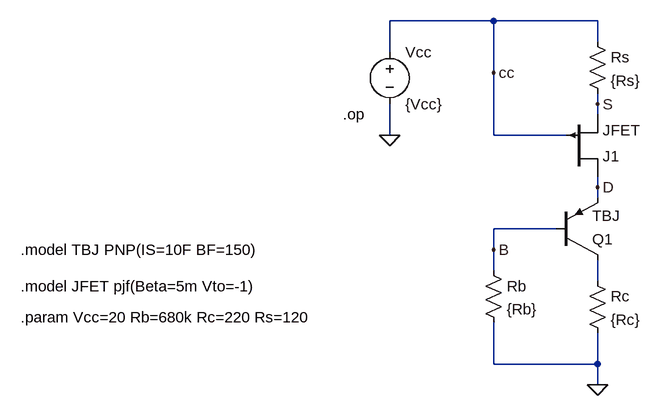
[diagram p0: schematic COMB00bop.asc]
COMB00bop.asc, the LTspice schematic file:
Version 4
SHEET 1 1608 1076
WIRE 1024 -224 864 -224
WIRE 1184 -224 1024 -224
WIRE 1184 -192 1184 -224
WIRE 864 -176 864 -224
WIRE 1024 -144 1024 -224
WIRE 1184 -96 1184 -112
WIRE 1184 -80 1184 -96
WIRE 864 -48 864 -96
WIRE 1024 -48 1024 -144
WIRE 1136 -48 1024 -48
WIRE 1184 32 1184 16
WIRE 1184 48 1184 32
WIRE 1120 96 1024 96
WIRE 1024 128 1024 96
WIRE 1024 160 1024 128
WIRE 1184 176 1184 144
WIRE 1024 304 1024 240
WIRE 1184 304 1184 256
WIRE 1184 304 1024 304
WIRE 1184 336 1184 304
FLAG 1184 336 0
FLAG 864 -48 0
FLAG 1024 -144 cc
FLAG 1024 128 B
FLAG 1184 -96 S
FLAG 1184 32 D
SYMBOL res 1008 144 R0
SYMATTR InstName Rb
SYMATTR Value {Rb}
SYMBOL res 1168 160 R0
SYMATTR InstName Rc
SYMATTR Value {Rc}
SYMBOL voltage 864 -192 R0
WINDOW 123 0 0 Left 0
WINDOW 39 0 0 Left 0
SYMATTR InstName Vcc
SYMATTR Value {Vcc}
SYMBOL res 1168 -208 R0
SYMATTR InstName Rs
SYMATTR Value {Rs}
SYMBOL pnp 1120 144 M180
SYMATTR InstName Q1
SYMATTR Value TBJ
SYMBOL pjf 1136 16 M180
SYMATTR InstName J1
SYMATTR Value JFET
TEXT 792 -80 Left 2 !.op
TEXT 296 184 Left 2 !.model JFET pjf(Beta=5m Vto=-1)
TEXT 296 232 Left 2 !.param Vcc=20 Rb=680k Rc=220 Rs=120
TEXT 296 128 Left 2 !.model TBJ PNP(IS=10F BF=150)

The netlist it stands for:
* COMB00bop.asc
Rb B 0 {Rb}
Rc N001 0 {Rc}
Vcc cc 0 {Vcc}
Rs cc S {Rs}
Q1 N001 B D 0 TBJ
J1 D cc S JFET
.model NPN NPN
.model PNP PNP
.lib standard.bjt
.model NJF NJF
.model PJF PJF
.lib standard.jft
.op
.model JFET pjf(Beta=5m Vto=-1)
.param Vcc=20 Rb=680k Rc=220 Rs=120
.model TBJ PNP(IS=10F BF=150)
.backanno
.end